# EAGLE design pu slim crystal save (EAGLE 7.6.0)
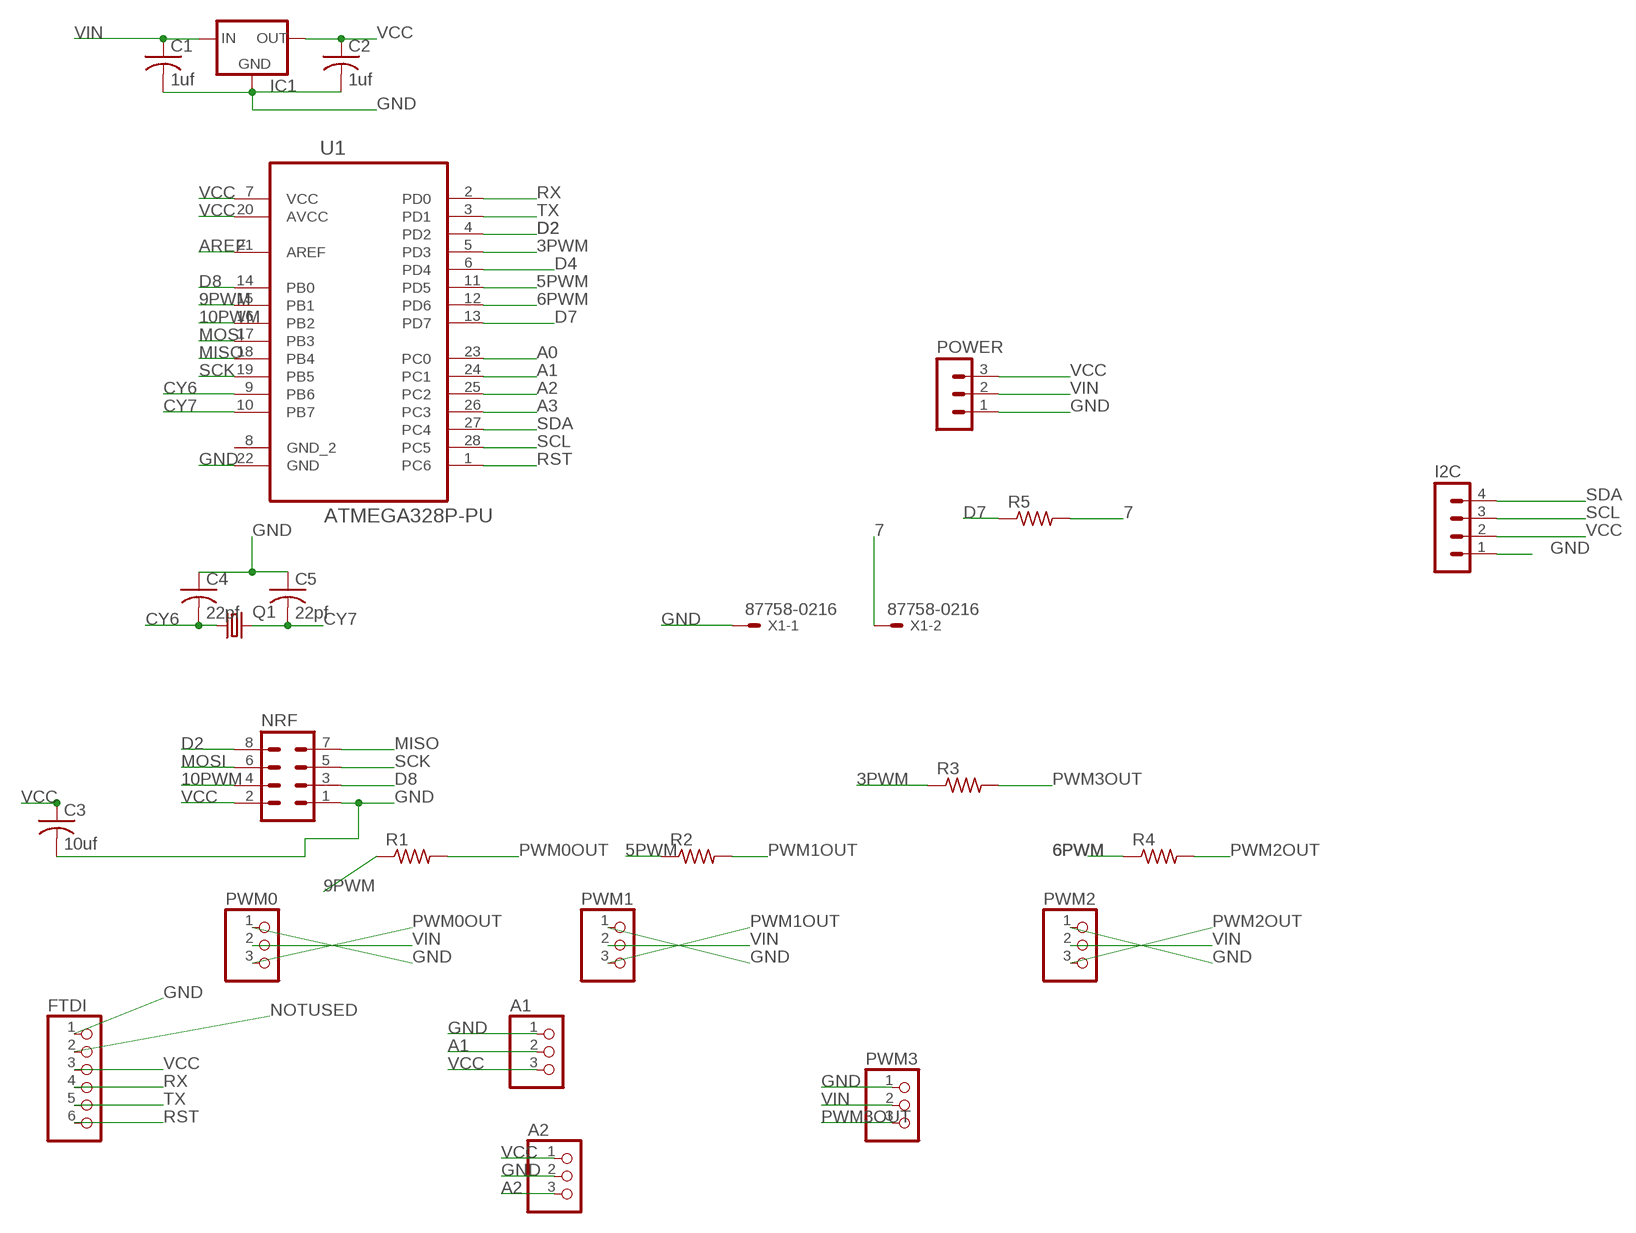
[diagram p0: schematic, sheet 1]

## Parts
A1  PINHD-1X3  [1X03]
A2  PINHD-1X3  [1X03]
C1  1uf  C-US025-025X050  [C025-025X050]
C2  1uf  C-US025-025X050  [C025-025X050]
C3  10uf  C-US025-025X050  [C025-025X050]
C4  22pf  C-US025-025X050  [C025-025X050]
C5  22pf  C-US025-025X050  [C025-025X050]
FTDI  PINHD-1X6CLEAN  [1X06-CLEAN]
I2C  MA04-1  [MA04-1]
IC1  MCP1700TRI  [TO92]
NRF  MA04-2  [MA04-2]
POWER  MA03-1  [MA03-1]
PWM0  PINHD-1X3  [1X03]
PWM1  PINHD-1X3  [1X03]
PWM2  PINHD-1X3  [1X03]
PWM3  PINHD-1X3  [1X03]
Q1  CRYSTALHC49U-V  [HC49U-V]
R1  R-US_0204/7  [0204/7]
R2  R-US_0204/7  [0204/7]
R3  R-US_0204/7  [0204/7]
R4  R-US_0204/7  [0204/7]
R5  R-US_0204/7  [0204/7]
U1  ATMEGA328P-PU  [DIP254P762X457-28]
X1  87758-0216  [87758-0216]

## Nets
3PWM: R3.1 U1.5(PD3)
5PWM: R2.1 U1.11(PD5)
6PWM: R4.1 U1.12(PD6)
7: R5.2 X1.2
9PWM: R1.1 U1.15(PB1)
10PWM: NRF.4 U1.16(PB2)
A0: U1.23(PC0)
A1: A1.2 U1.24(PC1)
A2: A2.3 U1.25(PC2)
A3: U1.26(PC3)
AREF: U1.21(AREF)
CY6: C4.2 Q1.1 U1.9(PB6)
CY7: C5.2 Q1.2 U1.10(PB7)
D2: NRF.8 U1.4(PD2)
D4: U1.6(PD4)
D7: R5.1 U1.13(PD7)
D8: NRF.3 U1.14(PB0)
GND: A1.1 A2.2 C1.2 C2.2 C3.2 C4.1 C5.1 FTDI.1 I2C.1 IC1.1(GND) NRF.1 POWER.1 PWM0.1 PWM1.1 PWM2.1 PWM3.1 U1.22(GND) X1.1
MISO: NRF.7 U1.18(PB4)
MOSI: NRF.6 U1.17(PB3)
NOTUSED: FTDI.2
PWM0OUT: PWM0.3 R1.2
PWM1OUT: PWM1.3 R2.2
PWM2OUT: PWM2.3 R4.2
PWM3OUT: PWM3.3 R3.2
RST: FTDI.6 U1.1(PC6)
RX: FTDI.4 U1.2(PD0)
SCK: NRF.5 U1.19(PB5)
SCL: I2C.3 U1.28(PC5)
SDA: I2C.4 U1.27(PC4)
TX: FTDI.5 U1.3(PD1)
VCC: A1.3 A2.1 C2.1 C3.1 FTDI.3 I2C.2 IC1.3(OUT) NRF.2 POWER.3 U1.7(VCC) U1.20(AVCC)
VIN: C1.1 IC1.2(IN) POWER.2 PWM0.2 PWM1.2 PWM2.2 PWM3.2
Unconnected: U1.8(GND_2)

## Library data of the parts
A1 A2 PWM0 PWM1-PWM3 = adafruit:PINHD-1X3: PIN HEADER
C1-C5 = adafruit:C-US: CAPACITOR, American symbol
FTDI = adafruit:PINHD-1X6: PIN HEADER
I2C = con-lstb:MA04-1: PIN HEADER; OC_FARNELL: unknown; OC_NEWARK: unknown
IC1 = adafruit:MCP1700: VOLTAGE REGULATOR
NRF = con-lstb:MA04-2: PIN HEADER; OC_FARNELL: unknown; OC_NEWARK: unknown
POWER = con-lstb:MA03-1: PIN HEADER; OC_FARNELL: unknown; OC_NEWARK: unknown
Q1 = crystal:CRYSTAL: CRYSTAL; OC_FARNELL: 1666969; OC_NEWARK: unknown
R1-R5 = resistor:R-US_: RESISTOR, American symbol
U1 = Atmel_By_element14_Batch_1-00:ATMEGA328P-PU: 8-bit Microcontroller with In-System Programmable Flash; MPN: ATMEGA328P-PU; OC_FARNELL: 1715487; OC_NEWARK: 15R0268; PACKAGE: PDIP-28; SUPPLIER: Atmel
X1 = con-molex:87758-0216: 2 Pin - 2mm Dual Row Single Wafer, Vertical T/H HDR Source: http://www.molex.com/pdm_docs/sd/877580616_sd.pdf; MPN: 87758-0216; OC_FARNELL: unknown; OC_NEWARK: 94M1513

## Board
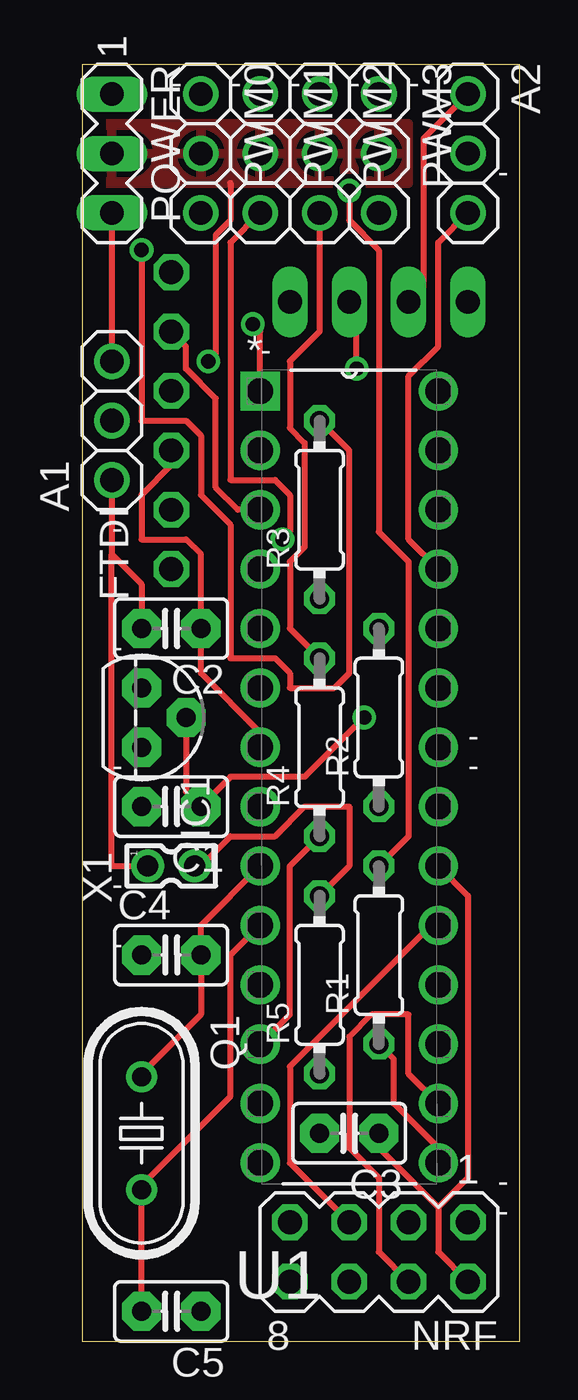
[diagram p1: board, top side]
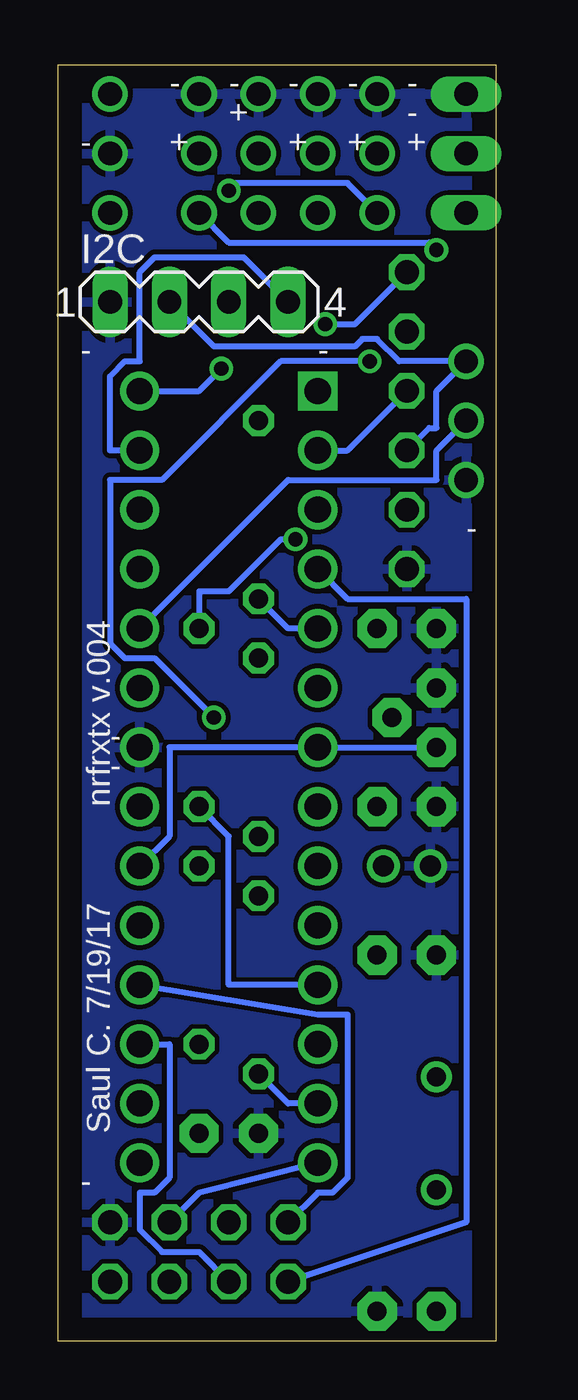
[diagram p2: board, bottom side, seen from below]

Size 18.72 x 54.6 mm. Coordinates in mm from the lower left corner, seen from the top.
Outline: 0,0 18.72,0 18.72,54.6 0,54.6 0,0
Copper layers (1*16): Top 0.035mm / dielectric 1.5mm / Bottom 0.035mm
Design rules "default": minimum track width 10mil, minimum drill 24mil, track to track 8mil, track to pad 8mil, pad to pad 8mil, via to via 8mil, smd to smd 8mil, copper to edge 40mil, drill to drill 8mil, minimum pad ring 10mil, minimum via ring 8mil, stop-mask expansion 4mil, vias tented up to drill 0mil, thermal gap 10mil

### Footprints (pad centres in the part's own frame; a part is rotated, then mirrored left to right if it is on the bottom)
1X03 = drill 1.016: 1 -2.54,0; 2 0,0; 3 2.54,0
C025-025X050 = drill 0.813 pad 1.676 octagon: 1 -1.27,0; 2 1.27,0
1X06-CLEAN = drill 1.016 octagon: 1 -6.35,0; 2 -3.81,0; 3 -1.27,0; 4 1.27,0; 5 3.81,0; 6 6.35,0
MA04-1 = drill 1.016 long: 1 -3.81,0; 2 -1.27,0; 3 1.27,0; 4 3.81,0
TO92 = drill 0.813 pad 1.676 octagon: 1 -1.27,0; 2 0,1.905; 3 1.27,0
MA04-2 = drill 1.016 octagon: 1 -3.81,-1.27; 2 -3.81,1.27; 3 -1.27,-1.27; 4 -1.27,1.27; 5 1.27,-1.27; 6 1.27,1.27; 7 3.81,-1.27; 8 3.81,1.27
MA03-1 = drill 1.016 long: 1 -2.54,0; 2 0,0; 3 2.54,0
HC49U-V = drill 0.813: 1 -2.413,0; 2 2.413,0
0204/7 = drill 0.813 octagon: 1 -3.81,0; 2 3.81,0
DIP254P762X457-28 = drill 1.118 square: 1 -7.62,33.02 | drill 1.118: 2 -7.62,30.48; 3 -7.62,27.94; 4 -7.62,25.4; 5 -7.62,22.86; 6 -7.62,20.32; 7 -7.62,17.78; 8 -7.62,15.24; 9 -7.62,12.7; 10 -7.62,10.16; 11 -7.62,7.62; 12 -7.62,5.08; 13 -7.62,2.54; 14 -7.62,0; 15 0,0; 16 0,2.54; 17 0,5.08; 18 0,7.62; 19 0,10.16; 20 0,12.7; 21 0,15.24; 22 0,17.78; 23 0,20.32; 24 0,22.86; 25 0,25.4; 26 0,27.94; 27 0,30.48; 28 0,33.02
87758-0216 = drill 0.9 pad 1.27: 1 0,-1; 2 0,1

### Placement (x,y rotation side)
A1  1.27,39.37 90 top
A2  16.51,50.8 270 top
C1  3.81,22.86 180 top
C2  3.81,30.48 180 top
C3  11.43,8.89 180 top
C4  3.81,16.51 0 top
C5  3.81,1.27 180 top
FTDI  3.81,39.37 90 top
I2C  12.7,44.45 0 bottom
IC1  2.54,26.67 270 top
NRF  12.7,3.81 180 top
POWER  1.27,50.8 270 top
PWM0  5.08,50.8 270 top
PWM1  7.62,50.8 270 top
PWM2  10.16,50.8 270 top
PWM3  12.7,50.8 270 top
Q1  2.54,8.89 270 top
R1  12.7,16.51 90 top
R2  12.7,26.67 90 top
R3  10.16,35.56 90 top
R4  10.16,25.4 90 top
R5  10.16,15.24 90 top
U1  15.24,7.62 0 top
X1  3.81,20.32 270 top

### Tracks (layer width: path | path; a pad name or v marks a point on that pad's centre or on a via)
3PWM
  Bottom 0.254: R3.1 8.89,30.48 U1.5
5PWM
  Bottom 0.254: R2.1 11.43,21.59 11.43,15.24 U1.11
6PWM
  Top 0.254: R4.1 8.89,20.32 8.89,13.97 U1.12
7
  Top 0.254: R5.2 11.43,20.32 11.43,22.86 9.53,22.86 8.26,21.59 6.35,21.59 5.08,20.32 X1.2
9PWM
  Top 0.254: R1.1 13.34,12.06 13.34,10.16 15.24,8.26 U1.15
10PWM
  Top 0.254: NRF.4 12.7,3.81 12.7,6.99 11.43,8.26 11.43,13.02 12.38,13.97 13.97,13.97 13.97,11.43 U1.16
A1
  Bottom 0.254: A1.2 2.54,38.1 2.54,36.83 8.89,36.83 U1.24
A2
  Top 0.254: A2.3 15.24,46.99 15.24,42.55 13.97,41.27 13.97,34.29 U1.25
CY6
  Top 0.254: Q1.1 2.54,11.43 5.08,13.97 C4.2 5.08,17.78 U1.9
CY7
  Top 0.254: C5.2 Q1.2 2.54,6.67 6.35,10.48 6.35,16.51 U1.10
D2
  Bottom 0.254: NRF.8 1.27,5.08 1.27,31.75 6.35,31.75 U1.4
D7
  Bottom 0.254: R5.1 8.89,10.16 U1.13
D8
  Bottom 0.254: NRF.3 12.7,6.35 U1.14
GND
  Top 0.254: C2.2 2.54,32.38 1.27,33.66 | A1.1 1.27,33.66 | 1.27,33.66 1.27,20.32 X1.1
  pour Bottom: 29.21,64.77 -2.54,63.5 -2.54,0 29.21,0
MISO
  Bottom 0.254: NRF.7 7.62,6.35 6.99,6.35 6.35,6.99 6.35,13.97 7.62,13.97 U1.18
MOSI
  Bottom 0.254: NRF.6 12.7,3.81 14.29,3.81 15.24,4.76 15.24,6.35 14.61,6.35 13.97,6.99 13.97,12.7 U1.17
PWM0OUT  (via drill 0.61)
  Top 0.254: R1.2 13.97,21.59 13.97,33.34 12.7,34.61 12.7,46.67 11.43,47.94 v11.43,49.21
  Bottom 0.254: v11.43,49.21 11.11,49.53 6.35,49.53 PWM0.3
PWM1OUT  (via drill 0.61)
  Top 0.254: v8.57,34.29 8.89,34.61 8.89,36.2 8.26,36.83 6.35,36.83 6.35,46.99 PWM1.3
  Bottom 0.254: R2.2 12.7,32.07 11.43,32.07 9.21,34.29 v8.57,34.29
PWM2OUT
  Top 0.254: R4.2 8.89,30.48 8.89,33.34 9.53,33.97 9.53,38.42 8.89,39.05 8.89,41.91 10.16,43.18 PWM2.3
PWM3OUT  (via drill 0.61)
  Top 0.254: R3.2 11.43,38.1 11.43,28.57 10.79,27.94 8.89,27.94 8.89,28.57 8.26,29.21 6.35,29.21 6.35,34.92 5.08,36.2 5.08,38.73 4.45,39.37 2.54,39.37 v2.54,46.67
  Bottom 0.254: v2.54,46.67 2.86,46.99 11.43,46.99 PWM3.3
RST  (via drill 0.61)
  Top 0.254: v7.3,43.5 7.62,43.18 U1.1
  Bottom 0.254: FTDI.6 6.03,43.5 v7.3,43.5
RX
  Bottom 0.254: FTDI.4 6.35,38.1 U1.2
SCK
  Top 0.254: NRF.5 8.89,7.62 8.89,11.75 14.92,17.78 U1.19
SCL  (via drill 0.61)
  Top 0.254: I2C.3 11.75,44.13 v11.75,41.59
  Bottom 0.254: v11.75,41.59 12.7,40.64 U1.28
SDA
  Bottom 0.254: I2C.4 10.79,46.35 14.61,46.35 15.24,45.72 15.24,41.91 15.88,41.91 16.51,41.27 16.51,38.1 U1.27
TX
  Top 0.254: FTDI.5 4.45,42.55 4.45,41.59 5.71,40.32 5.71,36.51 6.67,35.56 U1.3
VCC
  Top 0.254: NRF.2 15.24,3.81 15.24,5.71 | 15.24,5.71 12.7,8.26 C3.1 | 15.24,5.71 16.51,6.99 16.51,19.05 U1.20 | I2C.2 14.61,45.09 14.61,51.44 A2.1 | POWER.3 A1.3 | U1.7 7.62,26.04 5.08,28.57 C2.1 5.08,33.66 4.45,34.29 2.54,34.29 2.54,36.2 3.81,37.47 FTDI.3
  Bottom 0.254: IC1.3 U1.7 13.97,25.4 13.97,21.59 U1.20 | FTDI.3 2.86,39.05 2.54,39.05 2.54,40.64 A1.3 4.13,41.91 5.08,42.86 5.71,42.86 6.03,42.55 12.06,42.55 I2C.2
VIN  (via drill 0.61)
  Top 0.254: v5.4,41.91 5.71,42.23 5.71,47.31 6.35,47.94 6.35,49.53 | IC1.2 4.45,23.5 C1.1 6.35,24.13 9.53,24.13 v12.06,26.67
  Bottom 0.254: v5.4,41.91 9.21,41.91 14.29,36.83 16.51,36.83 16.51,29.84 15.88,29.21 14.61,29.21 v12.06,26.67
  pour Top: 0,52.07 0,49.53 13.97,49.53 13.97,52.07

### Text on the board
tPlace: - | - | - | - | - | - | - | - | - | - | - | - | - | - | - | -
bPlace: - | - | - | - | - | - | + | + | + | + | + | - | - | - | - | - | - | nrfrxtx v.004 | Saul C. 7/19/17 | -